# EAGLE schematic bombidary (EAGLE 9.2.2)
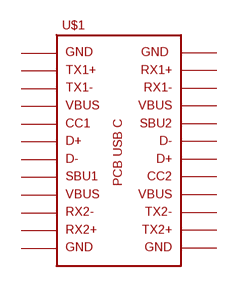
[diagram p0: schematic, sheet 1]

## Parts
U$1  PCB_USB_CDS_5  [USB_TYPE_C_DS_5]
Unconnected: U$1.A1 U$1.A2 U$1.A3 U$1.A4 U$1.A5 U$1.A6 U$1.A7 U$1.A8 U$1.A9 U$1.A10 U$1.A11 U$1.A12 U$1.B1 U$1.B2 U$1.B3 U$1.B4 U$1.B5 U$1.B6 U$1.B7 U$1.B8 U$1.B9 U$1.B10 U$1.B11 U$1.B12

## Library data of the parts
U$1 = USB_pcb_connectors:PCB_USB_C